# Altium schematic sheet BatteryChargerConn.SchDoc
size A3
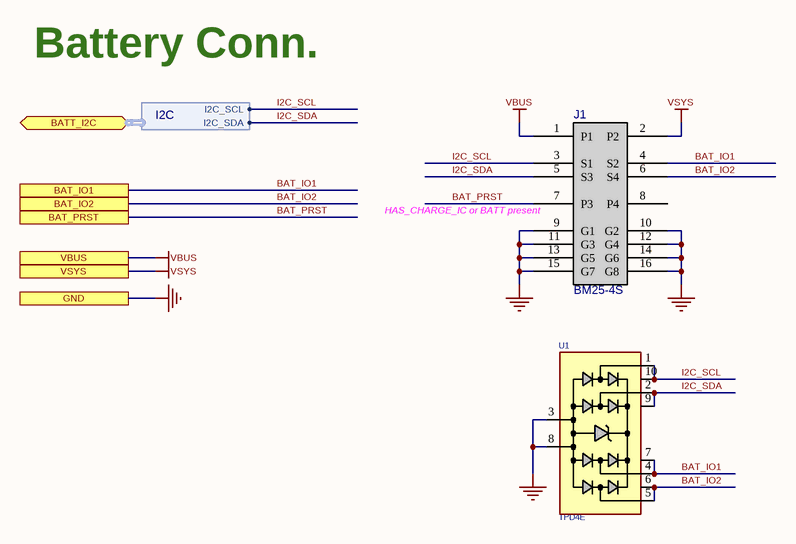
[diagram p0: BatteryChargerConn.SchDoc]

## Parts
J1  BM25-4S  [BM25_4S]
U1  TPD4E  [SON50_10_2510E]

## Ports
BAT_IO1, BAT_IO2, BAT_PRST, BATT_I2C (bidir, harness I2C), GND, VBUS, VSYS

## Harnesses
I2C: I2C_SCL, I2C_SDA

## Nets
GND: J1.9(G1) J1.10(G2) J1.11(G3) J1.12(G4) J1.13(G5) J1.14(G6) J1.15(G7) J1.16(G8) U1.3 U1.8 ; port GND
VBUS: J1.1(P1) ; port VBUS
VSYS: J1.2(P2) ; port VSYS
BAT_IO1: J1.4(S2) U1.4 U1.7 ; port BAT_IO1
BAT_IO2: J1.6(S4) U1.5 U1.6 ; port BAT_IO2
BAT_PRST: J1.7(P3) ; port BAT_PRST
I2C_SCL: J1.3(S1) U1.1 U1.10 ; port BATT_I2C.I2C_SCL
I2C_SDA: J1.5(S3) U1.2 U1.9 ; port BATT_I2C.I2C_SDA

Not connected (* = marked no-connect by the designer): J1 8(P4)

## Notes on the sheet
- Battery Conn.
- (near J1) HAS_CHARGE_IC or BATT present

## Library data of the parts
J1 = BM25-4S: BM25 Series B2B Connectors; MANF: HIROSE; DESC: Mating BM25-4P/2-V(51); MANF_P#: BM25-4S_2-V(53); PRICE: 0.1$; VALUE: BM25-4S
U1 = TVS_X4_TPD4E05U06: TVS, ESD PROTECT, 4CH,; MANF_P#: TPD4E05U06DQA; MANF: Texas Instruments; PARAM2: 6.5Vbr, 0.4pF, –40°~125°C; PARAM: ±12-kV ContactD, ±15-kVAirD; PRICE: 0.6$; VALUE: TPD4E